# Altium schematic sheet Interface_DigitalToCLP.SchDoc
size A4
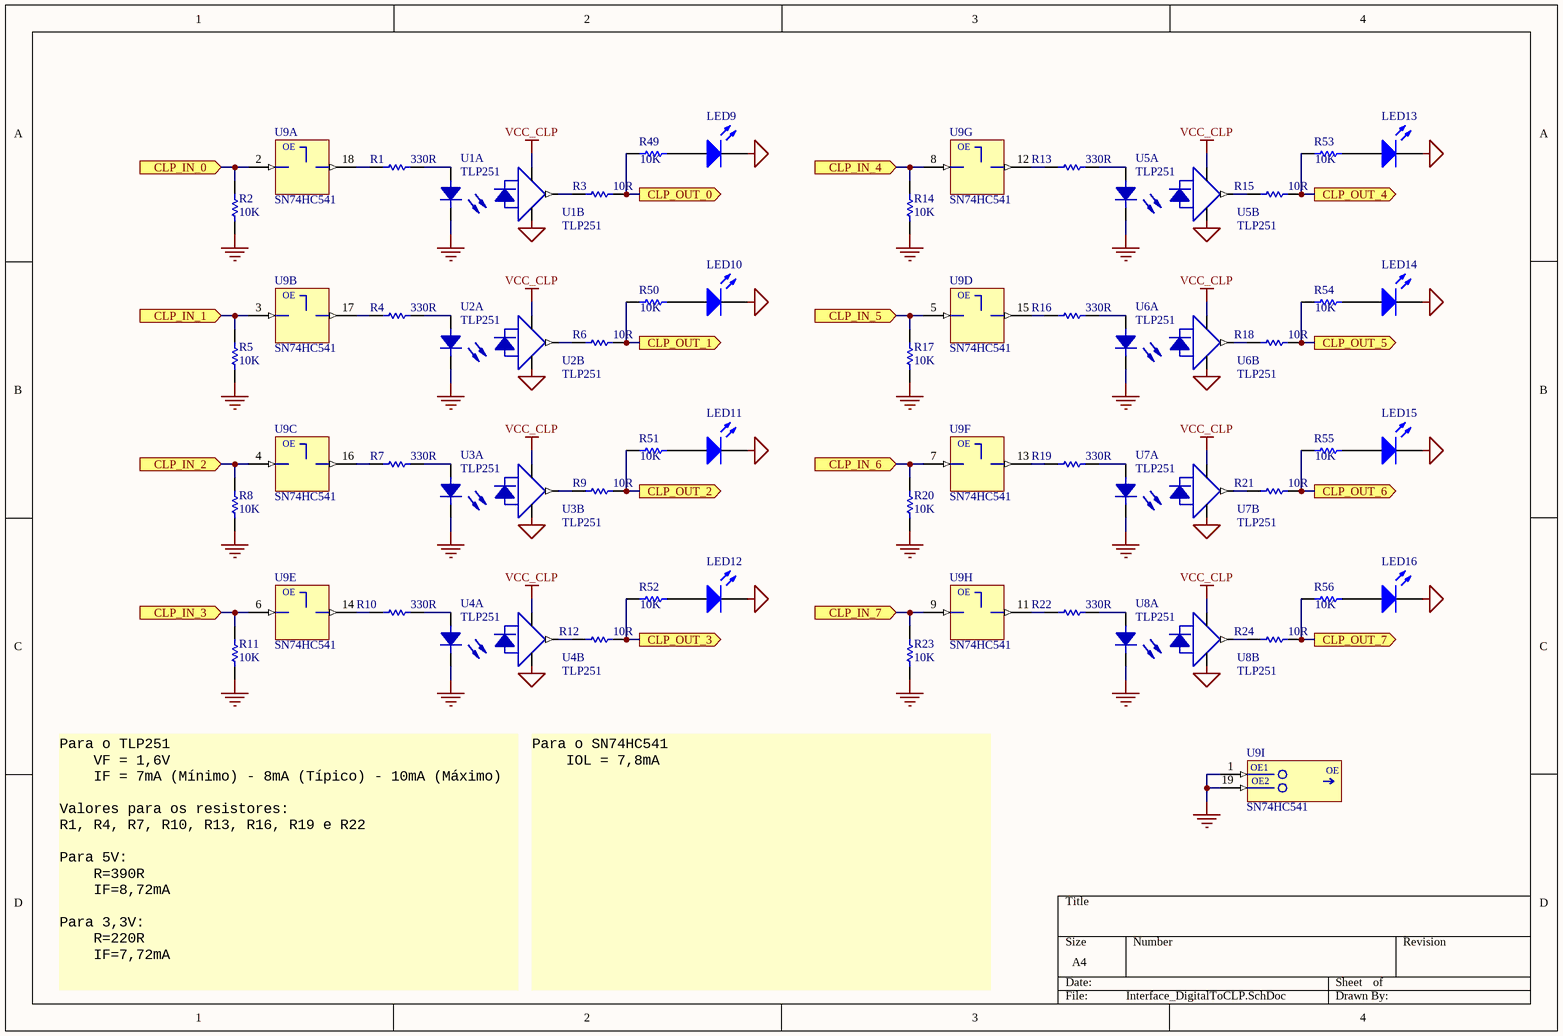
[diagram p0: Interface_DigitalToCLP.SchDoc]

## Parts
LED9  151053YS04500  [Type 5mm]  (value not drawn)
LED10  151053YS04500  [Type 5mm]  (value not drawn)
LED11  151053YS04500  [Type 5mm]  (value not drawn)
LED12  151053YS04500  [Type 5mm]  (value not drawn)
LED13  151053YS04500  [Type 5mm]  (value not drawn)
LED14  151053YS04500  [Type 5mm]  (value not drawn)
LED15  151053YS04500  [Type 5mm]  (value not drawn)
LED16  151053YS04500  [Type 5mm]  (value not drawn)
R1  330R  [CR25]
R2  10K  [CR25]
R3  10R  [CR25]
R4  330R  [CR25]
R5  10K  [CR25]
R6  10R  [CR25]
R7  330R  [CR25]
R8  10K  [CR25]
R9  10R  [CR25]
R10  330R  [CR25]
R11  10K  [CR25]
R12  10R  [CR25]
R13  330R  [CR25]
R14  10K  [CR25]
R15  10R  [CR25]
R16  330R  [CR25]
R17  10K  [CR25]
R18  10R  [CR25]
R19  330R  [CR25]
R20  10K  [CR25]
R21  10R  [CR25]
R22  330R  [CR25]
R23  10K  [CR25]
R24  10R  [CR25]
R49  value 10K  [AXIAL-0.3]  (hidden comment: Res1)
R50  value 10K  [AXIAL-0.3]  (hidden comment: Res1)
R51  value 10K  [AXIAL-0.3]  (hidden comment: Res1)
R52  value 10K  [AXIAL-0.3]  (hidden comment: Res1)
R53  value 10K  [AXIAL-0.3]  (hidden comment: Res1)
R54  value 10K  [AXIAL-0.3]  (hidden comment: Res1)
R55  value 10K  [AXIAL-0.3]  (hidden comment: Res1)
R56  value 10K  [AXIAL-0.3]  (hidden comment: Res1)
U1  TLP251  [DIP8]  (parts A,B of 2)
U2  TLP251  [DIP8]  (parts A,B of 2)
U3  TLP251  [DIP8]  (parts A,B of 2)
U4  TLP251  [DIP8]  (parts A,B of 2)
U5  TLP251  [DIP8]  (parts A,B of 2)
U6  TLP251  [DIP8]  (parts A,B of 2)
U7  TLP251  [DIP8]  (parts A,B of 2)
U8  TLP251  [DIP8]  (parts A,B of 2)
U9  SN74HC541  [PDIP20]  (parts A,B,C,D,E,F,G,H,I of 10)

## Ports
CLP_IN_0 (in), CLP_IN_1 (in), CLP_IN_2 (in), CLP_IN_3 (in), CLP_IN_4 (in), CLP_IN_5 (in), CLP_IN_6 (in), CLP_IN_7 (in), CLP_OUT_0 (out), CLP_OUT_1 (out), CLP_OUT_2 (out), CLP_OUT_3 (out), CLP_OUT_4 (out), CLP_OUT_5 (out), CLP_OUT_6 (out), CLP_OUT_7 (out)

## Nets
CLP_GND: LED9.1(K) LED10.1(K) LED11.1(K) LED12.1(K) LED13.1(K) LED14.1(K) LED15.1(K) LED16.1(K) U1.5 U2.5 U3.5 U4.5 U5.5 U6.5 U7.5 U8.5
GND: R2.1 R5.1 R8.1 R11.1 R14.1 R17.1 R20.1 R23.1 U1.3 U2.3 U3.3 U4.3 U5.3 U6.3 U7.3 U8.3 U9.1(OE1) U9.19(OE2)
VCC_CLP: U1.8 U2.8 U3.8 U4.8 U5.8 U6.8 U7.8 U8.8
CLP_IN_0: R2.2 U9.2(A1) ; port CLP_IN_0
CLP_IN_1: R5.2 U9.3(A2) ; port CLP_IN_1
CLP_IN_2: R8.2 U9.4(A3) ; port CLP_IN_2
CLP_IN_3: R11.2 U9.6(A5) ; port CLP_IN_3
CLP_IN_4: R14.2 U9.8(A7) ; port CLP_IN_4
CLP_IN_5: R17.2 U9.5(A4) ; port CLP_IN_5
CLP_IN_6: R20.2 U9.7(A6) ; port CLP_IN_6
CLP_IN_7: R23.2 U9.9(A8) ; port CLP_IN_7
CLP_OUT_0: R3.2 R49.2 ; port CLP_OUT_0
CLP_OUT_1: R6.2 R50.2 ; port CLP_OUT_1
CLP_OUT_2: R9.2 R51.2 ; port CLP_OUT_2
CLP_OUT_3: R12.2 R52.2 ; port CLP_OUT_3
CLP_OUT_4: R15.2 R53.2 ; port CLP_OUT_4
CLP_OUT_5: R18.2 R54.2 ; port CLP_OUT_5
CLP_OUT_6: R21.2 R55.2 ; port CLP_OUT_6
CLP_OUT_7: R24.2 R56.2 ; port CLP_OUT_7
NetLED9_2: LED9.2(A) R49.1
NetLED10_2: LED10.2(A) R50.1
NetLED11_2: LED11.2(A) R51.1
NetLED12_2: LED12.2(A) R52.1
NetLED13_2: LED13.2(A) R53.1
NetLED14_2: LED14.2(A) R54.1
NetLED15_2: LED15.2(A) R55.1
NetLED16_2: LED16.2(A) R56.1
NetR1_1: R1.1 U9.18(Y1)
NetR1_2: R1.2 U1.2
NetR3_1: R3.1 U1.6
NetR4_1: R4.1 U9.17(Y2)
NetR4_2: R4.2 U2.2
NetR6_1: R6.1 U2.6
NetR7_1: R7.1 U9.16(Y3)
NetR7_2: R7.2 U3.2
NetR9_1: R9.1 U3.6
NetR10_1: R10.1 U9.14(Y5)
NetR10_2: R10.2 U4.2
NetR12_1: R12.1 U4.6
NetR13_1: R13.1 U9.12(Y7)
NetR13_2: R13.2 U5.2
NetR15_1: R15.1 U5.6
NetR16_1: R16.1 U9.15(Y4)
NetR16_2: R16.2 U6.2
NetR18_1: R18.1 U6.6
NetR19_1: R19.1 U9.13(Y6)
NetR19_2: R19.2 U7.2
NetR21_1: R21.1 U7.6
NetR22_1: R22.1 U9.11(Y8)
NetR22_2: R22.2 U8.2
NetR24_1: R24.1 U8.6

## Notes on the sheet
- Para o TLP251
  VF = 1,6V
  IF = 7mA (Mínimo) - 8mA (Típico) - 10mA (Máximo)
  Valores para os resistores:
  R1, R4, R7, R10, R13, R16, R19 e R22
  Para 5V:
  R=390R
  IF=8,72mA
  Para 3,3V:
  R=220R
  IF=7,72mA
- Para o SN74HC541
  IOL = 7,8mA
- (in symbol SN74HC541, part A) OE
- (in symbol SN74HC541, part B) OE
- (in symbol SN74HC541, part C) OE
- (in symbol SN74HC541, part D) OE
- (in symbol SN74HC541, part E) OE
- (in symbol SN74HC541, part F) OE
- (in symbol SN74HC541, part G) OE
- (in symbol SN74HC541, part H) OE
- (in symbol SN74HC541, part I) OE

## Library data of the parts
LED9-LED16 = CMP-1477-00001-1: THT LED round mono-color waterclear, WL-TMRW, Yellow; Manufacturer: Wuerth Elektronik; ComponentLink2URL: http://katalog.we-online.de/pbs/datasheet/7448042001.pdfhttp://katalog.we-online.de/pbs/datasheet/7448042001.pdfhttp://katalog.we-online.de/pbs/datasheet/7448042001.pdfhttp://katalog.we-online.de/pbs/datasheet/151053YS04500.pdf; Emitting color: Yellow; PackageReference: Type 5mm; ComponentLink1URL: http://www.we-online.com; PartNumber: 151053YS04500; ComponentLink2Description: Datasheet; ComponentLink1Description: Manufacturer URL
R1-R24 = Resistor
R49-R56 = Res1: Resistor; Published: 8-Jun-2000; LatestRevisionDate: 17-Jul-2002; LatestRevisionNote: Re-released for DXP Platform.; PackageReference: AXIAL-0.3; Publisher: Altium Limited; PackageDescription: Axial Device, Thru-Hole; 2 Leads; 0.3 in Pin Spacing
U1-U8 = TLP251: Photocoupler
U9 = SN74HC541: Octal Buffers and Line Drivers With 3-State Outputs